# EAGLE schematic ChillmonBoard (EAGLE 6.3)
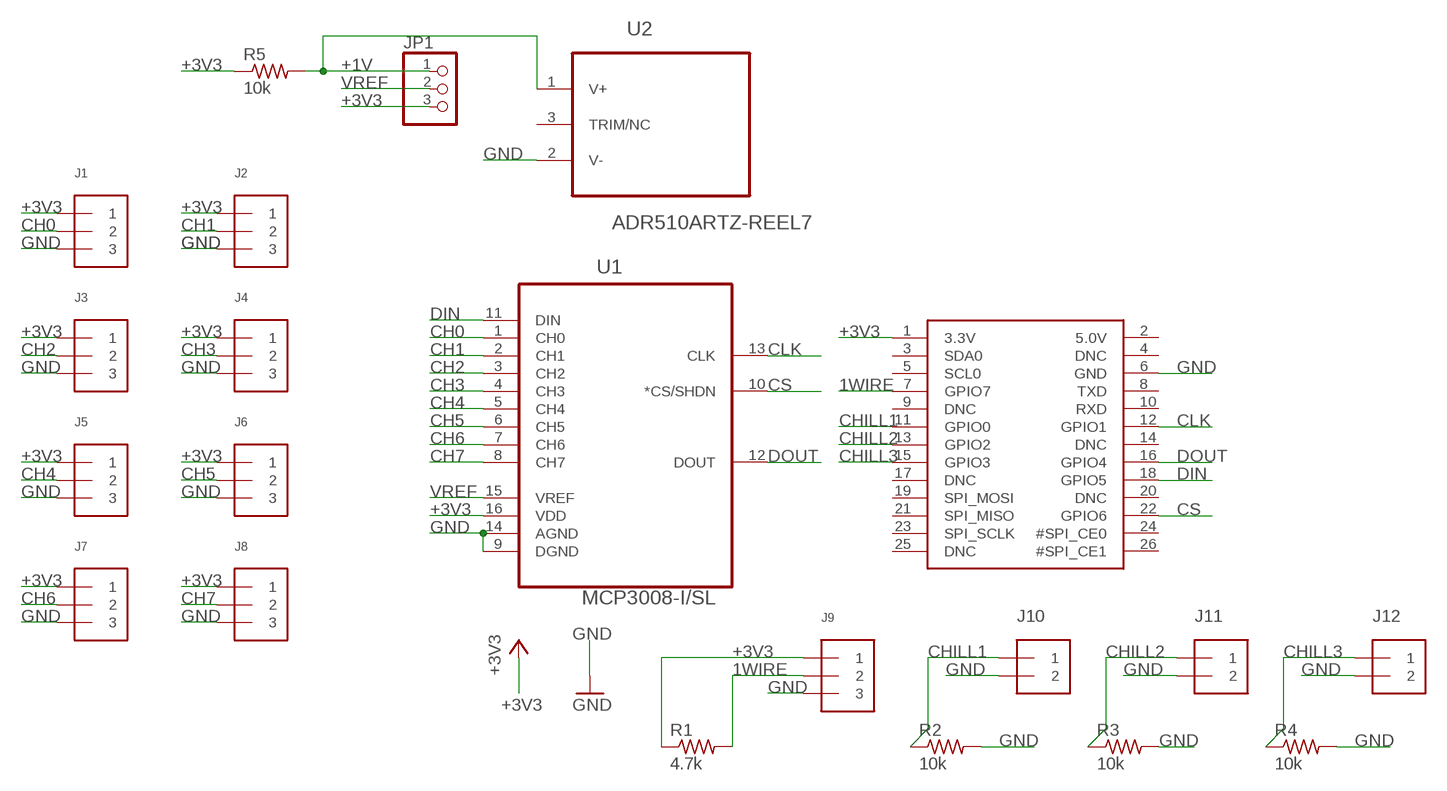
[diagram p0: schematic, sheet 1]

## Parts
J1  TERMBLOCK_1X3  [TERMBLOCK_1X3-3.5MM]
J2  TERMBLOCK_1X3  [TERMBLOCK_1X3-3.5MM]
J3  TERMBLOCK_1X3  [TERMBLOCK_1X3-3.5MM]
J4  TERMBLOCK_1X3  [TERMBLOCK_1X3-3.5MM]
J5  TERMBLOCK_1X3  [TERMBLOCK_1X3-3.5MM]
J6  TERMBLOCK_1X3  [TERMBLOCK_1X3-3.5MM]
J7  TERMBLOCK_1X3  [TERMBLOCK_1X3-3.5MM]
J8  TERMBLOCK_1X3  [TERMBLOCK_1X3-3.5MM]
J9  TERMBLOCK_1X3  [TERMBLOCK_1X3-3.5MM]
J10  1X2-3.5MM  [1X2-3.5MM]
J11  1X2-3.5MM  [1X2-3.5MM]
J12  1X2-3.5MM  [1X2-3.5MM]
JP1  PINHD-1X3  [1X03]
R1  4.7k  R-US_R0805  [R0805]
R2  10k  R-US_R0805  [R0805]
R3  10k  R-US_R0805  [R0805]
R4  10k  R-US_R0805  [R0805]
R5  10k  R-US_R0805  [R0805]
U1  MCP3008-I/SL  [SOIC127P600X175-16N]
U2  ADR510ARTZ-REEL7  [SOT95P237X112-3N]
U$1  RASPBERRYPI_BB  [RASBERRYPI_SHIELD]

## Nets
1WIRE: J9.2 R1.2 U$1.7(GPIO7)
+1V: JP1.1 R5.2 U2.1(V+)
+3V3: J1.1 J2.1 J3.1 J4.1 J5.1 J6.1 J7.1 J8.1 J9.1 JP1.3 R1.1 R5.1 U1.16(VDD) U$1.1(3.3V)
CH0: J1.2 U1.1(CH0)
CH1: J2.2 U1.2(CH1)
CH2: J3.2 U1.3(CH2)
CH3: J4.2 U1.4(CH3)
CH4: J5.2 U1.5(CH4)
CH5: J6.2 U1.6(CH5)
CH6: J7.2 U1.7(CH6)
CH7: J8.2 U1.8(CH7)
CHILL1: J10.1 R2.1 U$1.11(GPIO0)
CHILL2: J11.1 R3.1 U$1.13(GPIO2)
CHILL3: J12.1 R4.1 U$1.15(GPIO3)
CLK: U1.13(CLK) U$1.12(GPIO1)
CS: U1.10(*CS/SHDN) U$1.22(GPIO6)
DIN: U1.11(DIN) U$1.18(GPIO5)
DOUT: U1.12(DOUT) U$1.16(GPIO4)
GND: J1.3 J2.3 J3.3 J4.3 J5.3 J6.3 J7.3 J8.3 J9.3 J10.2 J11.2 J12.2 R2.2 R3.2 R4.2 U1.9(DGND) U1.14(AGND) U2.2(V-) U$1.6(GND)
VREF: JP1.2 U1.15(VREF)
Unconnected: U2.3(TRIM/NC) U$1.2(5.0V) U$1.3(SDA0) U$1.4(DNC) U$1.5(SCL0) U$1.8(TXD) U$1.9(DNC) U$1.10(RXD) U$1.14(DNC) U$1.17(DNC) U$1.19(SPI_MOSI) U$1.20(DNC) U$1.21(SPI_MISO) U$1.23(SPI_SCLK) U$1.24(#SPI_CE0) U$1.25(DNC) U$1.26(#SPI_CE1)

## Notes on the sheet
- J10 | J11 | J12

## Library data of the parts
J1-J9 = microbuilder:TERMBLOCK_1X3: 3.5mm Terminal block http://www.ladyada.net/library/pcb/eaglelibrary.html
J10-J12 = adafruit:1X2: 3.5mm Terminal block http://www.ladyada.net/library/pcb/eaglelibrary.html
JP1 = adafruit:PINHD-1X3: PIN HEADER
R1-R5 = adafruit:R-US_: RESISTOR, American symbol
U1 = MCP3008:MCP3008-I/SL: 10BIT ADC, 8 CH, SPI, SMD; MPN: MCP3008-I/SL; OC_FARNELL: 1292241; OC_NEWARK: 19C7201; PACKAGE: SOIC16; SUPPLIER: Microchip
U2 = ADR510:ADR510ARTZ-REEL7: 1.0 V Precision Low Noise Shunt Voltage Reference; MPN: ADR510ARTZ-REEL7; OC_FARNELL: -; OC_NEWARK: 19M8736; PACKAGE: SOT-23-3; SUPPLIER: Analog Devices
U$1 = Chillmon:RASPBERRYPI_B